# Altium schematic sheet [11] - LCD.SchDoc
size A3; DocumentNumber: 11; SheetNumber: 11; SheetTotal: 18
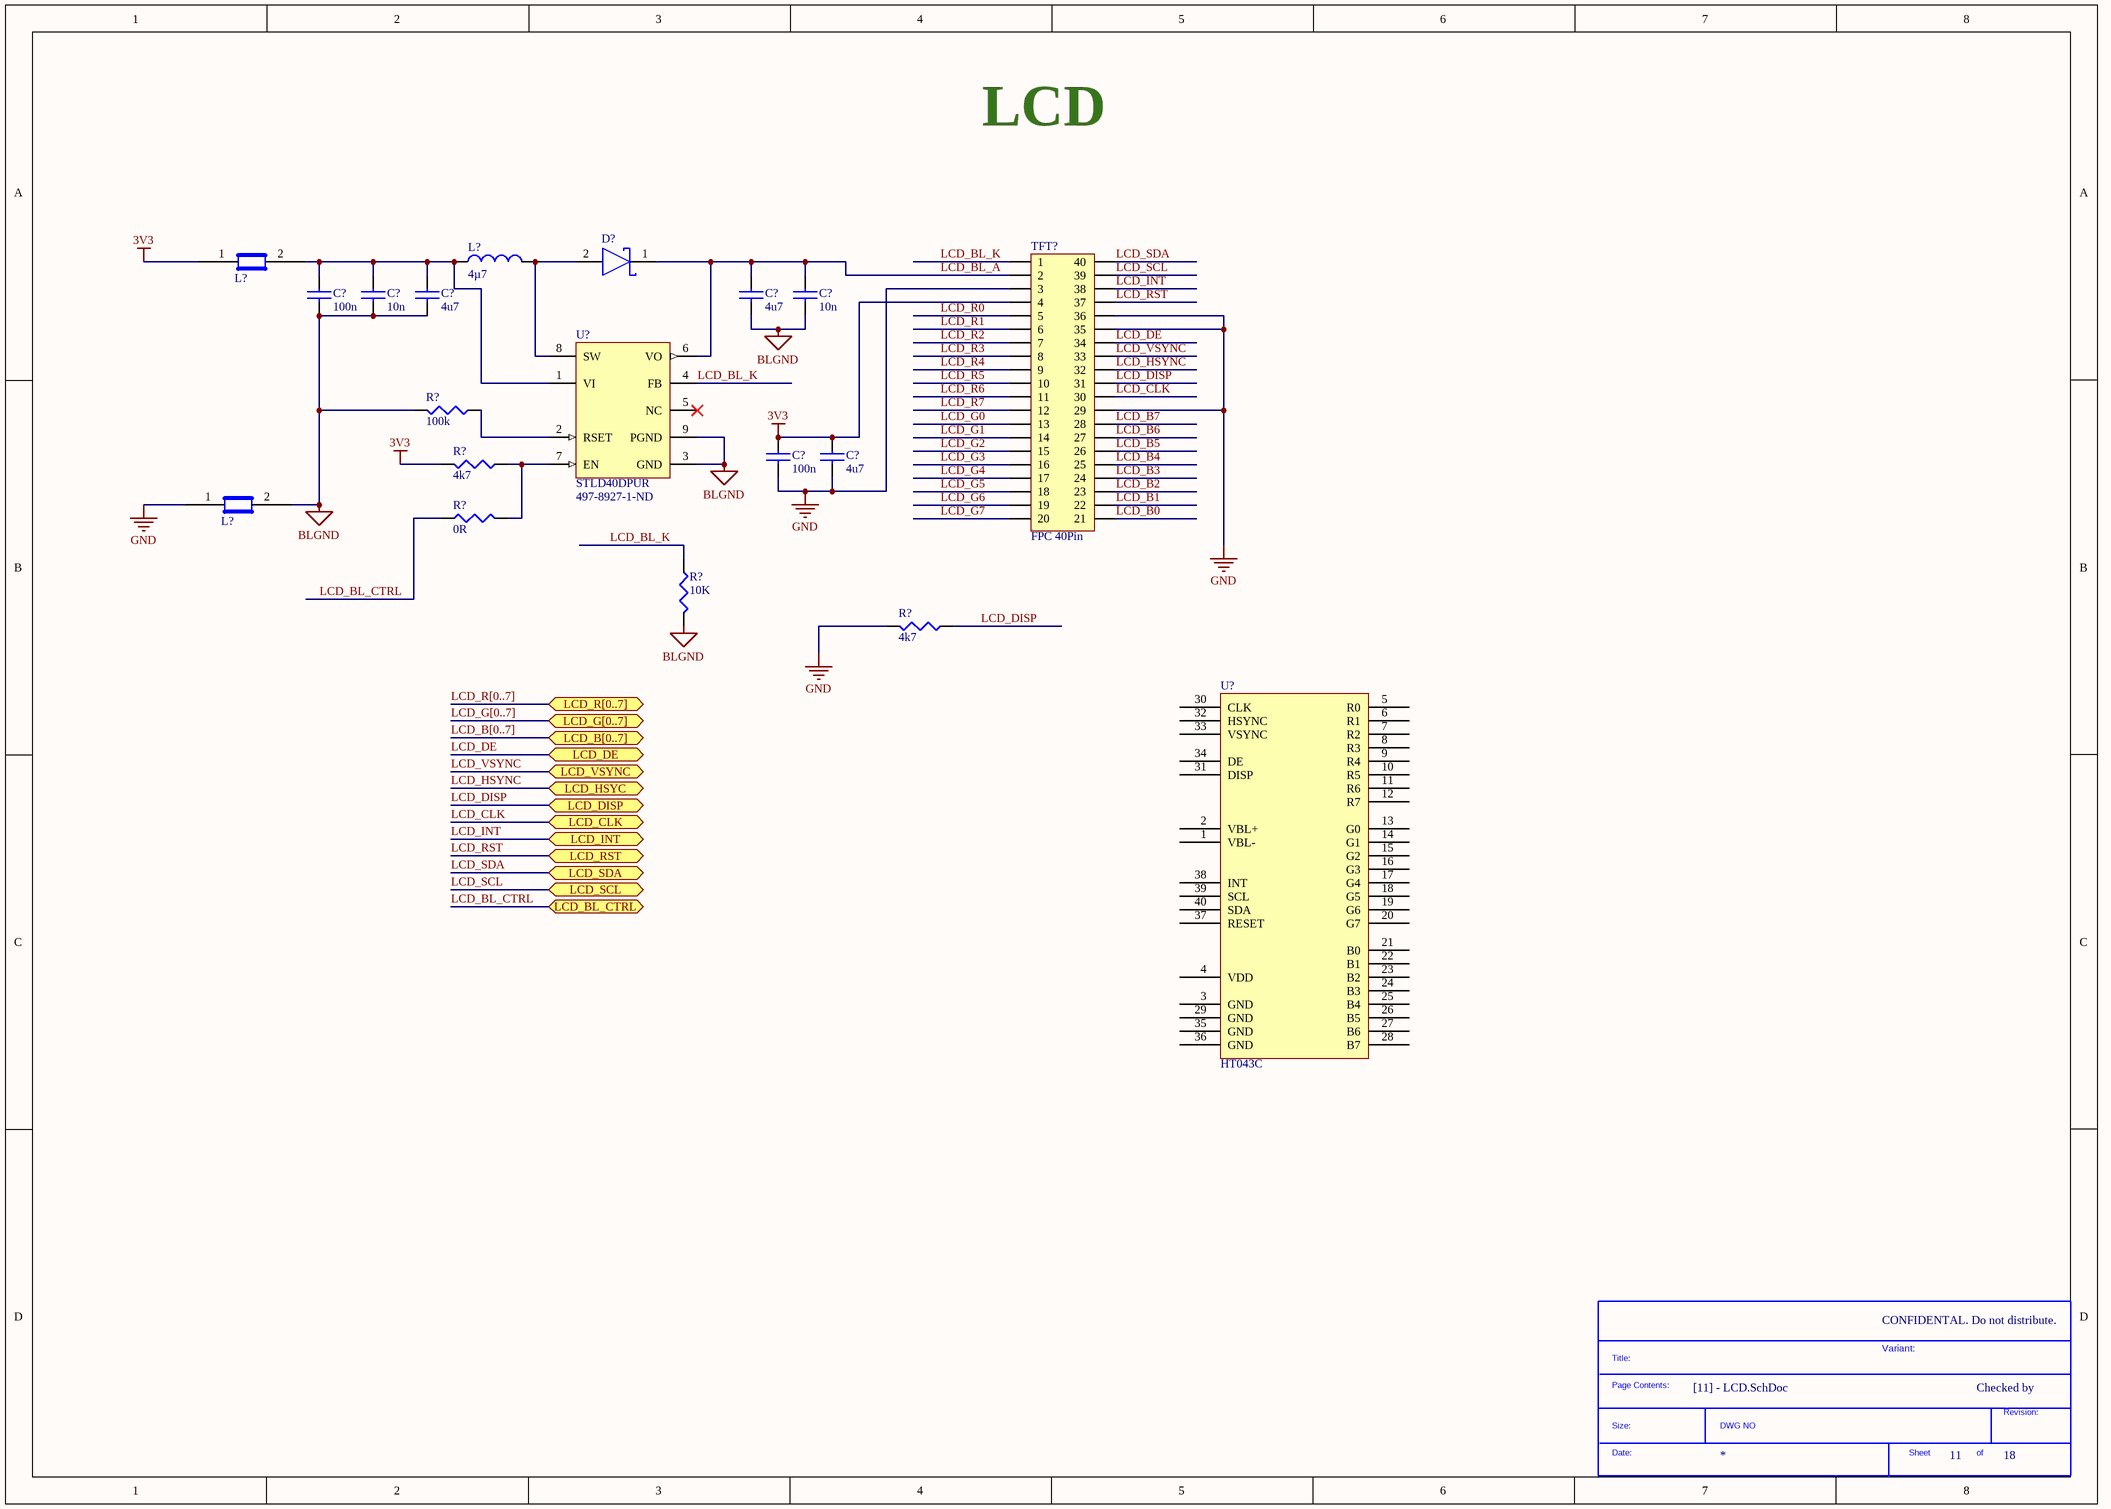
[diagram p0: [11] - LCD.SchDoc]

## Parts
(Parts that share a designator on the sheet are numbered #1, #2 ... from top to bottom, then left to right.)
*  SDTitleBlock  (value not drawn)  (graphical)
C?#1  100n  [C0402]
C?#2  10n  [C0402]
C?#3  4u7  [C0402]
C?#4  4u7  [C0402]
C?#5  10n  [C0402]
C?#6  100n  [C0402]
C?#7  4u7  [C0402]
D?  STPS1L40M  [STPS1L40M]  (value not drawn)
L?#1  MPZ1608S601A 600OHM/1A  [C0603]  (value not drawn)
L?#2  4µ7  [IHLP_255MILx270MIL]
L?#3  MPZ1608S601A 600OHM/1A  [C0603]  (value not drawn)
R?#1  100k  [R0402]
R?#2  4k7  [R0402]
R?#3  0R  [R0402]
R?#4  10K  [R0402]
R?#5  4k7  [R0402]
TFT?  FPC 40Pin  [FPC_40Pin]
U?#1  STLD40DPUR  Supplier Part Number 1: 497-8927-1-ND  [QFN8_V]
U?#2  HT043C  [LCD_Kunjian_ HT043C_40P_P080_FLEX_FOLDED]

## Ports
LCD_B[0..7] (bidir), LCD_BL_CTRL (bidir), LCD_CLK (bidir), LCD_DE (bidir), LCD_DISP (bidir), LCD_G[0..7] (bidir), LCD_HSYC (bidir), LCD_INT (bidir), LCD_R[0..7] (bidir), LCD_RST (bidir), LCD_SCL (bidir), LCD_SDA (bidir), LCD_VSYNC (bidir)

## Nets
3V3: C?#6.1 C?#7.1 L?#1.1 R?#2.2 TFT?.4
BLGND: C?#1.2 C?#2.2 C?#3.2 C?#4.2 C?#5.2 L?#3.2 R?#1.2 R?#4.2 U?#1.3(GND) U?#1.9(PGND)
GND: C?#6.2 C?#7.2 L?#3.1 R?#5.2 TFT?.3 TFT?.29 TFT?.35 TFT?.36
LCD_B0: TFT?.21
LCD_B1: TFT?.22
LCD_B2: TFT?.23
LCD_B3: TFT?.24
LCD_B4: TFT?.25
LCD_B5: TFT?.26
LCD_B6: TFT?.27
LCD_B7: TFT?.28
LCD_BL_A: C?#4.1 C?#5.1 D?.1(K) TFT?.2 U?#1.6(VO)
LCD_BL_CTRL: R?#3.1 ; port LCD_BL_CTRL
LCD_BL_K: R?#4.1 TFT?.1 U?#1.4(FB)
LCD_CLK: TFT?.30 ; port LCD_CLK
LCD_DE: TFT?.34 ; port LCD_DE
LCD_DISP: R?#5.1 TFT?.31 ; port LCD_DISP
LCD_G0: TFT?.13
LCD_G1: TFT?.14
LCD_G2: TFT?.15
LCD_G3: TFT?.16
LCD_G4: TFT?.17
LCD_G5: TFT?.18
LCD_G6: TFT?.19
LCD_G7: TFT?.20
LCD_HSYNC: TFT?.32 ; port LCD_HSYC
LCD_INT: TFT?.38 ; port LCD_INT
LCD_R0: TFT?.5
LCD_R1: TFT?.6
LCD_R2: TFT?.7
LCD_R3: TFT?.8
LCD_R4: TFT?.9
LCD_R5: TFT?.10
LCD_R6: TFT?.11
LCD_R7: TFT?.12
LCD_RST: TFT?.37 ; port LCD_RST
LCD_SCL: TFT?.39 ; port LCD_SCL
LCD_SDA: TFT?.40 ; port LCD_SDA
LCD_VSYNC: TFT?.33 ; port LCD_VSYNC
NetC?#1_1: C?#1.1 C?#2.1 C?#3.1 L?#1.2 L?#2.1 U?#1.1(VI)
NetD?_2: D?.2(A) L?#2.2 U?#1.8(SW)
NetR?#1_1: R?#1.1 U?#1.2(RSET)
NetR?#2_1: R?#2.1 R?#3.2 U?#1.7(EN)

Not connected (* = marked no-connect by the designer): U?#1 5(NC)*; U?#2 1(VBL-) 2(VBL+) 3(GND) 4(VDD) 5(R0) 6(R1) 7(R2) 8(R3) 9(R4) 10(R5) 11(R6) 12(R7) 13(G0) 14(G1) 15(G2) 16(G3) 17(G4) 18(G5) 19(G6) 20(G7) 21(B0) 22(B1) 23(B2) 24(B3) 25(B4) 26(B5) 27(B6) 28(B7) 29(GND) 30(CLK) 31(DISP) 32(HSYNC) 33(VSYNC) 34(DE) 35(GND) 36(GND) 37(RESET) 38(INT) 39(SCL) 40(SDA)

## Buses and harness runs
bus LCD_B[0..7] = port LCD_B[0..7]
bus LCD_G[0..7] = port LCD_G[0..7]
bus LCD_R[0..7] = port LCD_R[0..7]

## Notes on the sheet
- LCD
- CONFIDENTAL. Do not distribute.
- CLOCKS (CPU & PCIE)
- Variant:
- Checked by
- (in symbol SDTitleBlock) Title:; Page Contents:; Revision:; Size:; DWG NO; Date:; Sheet; of

## Library data of the parts
C?#1 C?#6 = C1005X5R1H104K: CAP CER .10UF 50V X5R 10% 0402; Manufacturer: TDK Corporation; Capacitance: 0.1µF; Value: 100nF; .Checked PCB: used; Category: Capacitors; Supplier Part Number: 445-5942-1-ND; Manufacturer Part Number: C1005X5R1H104K; Operating Temperature: -55°C ~ 85°C; Package / Case: 0402 (1005 Metric); Price 1k [$]: 0.02340; .Checked SCH: used; Voltage - Rated: 50V; Supplier: Digikey; Supplier 1: Digi-Key; Supplier Part Number 1: 445-5942-1-ND; RoHS: RoHS Compliant; Stock 1: 106926; Pricing 1: 1=0.27, 10=0.18, 100=0.072, 250=0.05176, 500=0.0369, 1000=0.027 (USD); Tolerance: ±10%; Temperature Coefficient: X5R; Mounting Type: Surface Mount, MLCC; Applications: General Purpose; Ratings: -; Size / Dimension: 0.039" L x 0.020" W (1.00mm x 0.50mm); Height - Seated (Max): -; Thickness (Max): 0.022" (0.55mm); Lead Spacing: -; Features: -; Packaging: Cut Tape (CT); Lead Style: -; ComponentLink1URL: http://www.tdk.co.jp/tefe02/e412_c.pdf; ComponentLink1Description: http://www.tdk.co.jp/tefe02/e412_c.pdf
C?#2 C?#5 = C1005X7R1C103K: CAP CER 10000PF 16V X7R 10% 0402; Manufacturer: TDK Corporation; Value: 10nF; .Checked PCB: used; Capacitance: 10000pF; Category: Capacitors; Manufacturer Part Number: C1005X7R1C103K; Operating Temperature: -55°C ~ 125°C; Package / Case: 0402 (1005 Metric); Price 1k [$]: 0.00416; .Checked SCH: used; Voltage - Rated: 16V; Supplier Part Number: 445-1262-1-ND; Supplier: Digikey; Supplier 1: Digi-Key; Supplier Part Number 1: 445-1262-1-ND; RoHS: RoHS Compliant; Stock 1: 511497; Pricing 1: 1=0.08, 10=0.05, 100=0.018, 250=0.013, 500=0.0096, 1000=0.0065 (USD); Tolerance: ±10%; Temperature Coefficient: X7R; Mounting Type: Surface Mount, MLCC; Applications: General Purpose; Ratings: -; Size / Dimension: 0.039" L x 0.020" W (1.00mm x 0.50mm); Height - Seated (Max): -; Thickness (Max): 0.022" (0.55mm); Lead Spacing: -; Features: -; Packaging: Cut Tape (CT); Lead Style: -; ComponentLink1URL: http://www.tdk.co.jp/tefe02/e412_c.pdf; ComponentLink1Description: http://www.tdk.co.jp/tefe02/e412_c.pdf
C?#3 C?#4 C?#7 = C1005X5R1A475M: CAP CER 4.7UF 10V 20% X5R 0402; Manufacturer: TDK Corporation; Capacitance: 4.7µF; .Checked PCB: RF; Supplier 1: Digi-Key; Supplier Part Number 1: 445-8023-1-ND; Manufacturer Part Number: C1005X5R1A475M; RoHS: RoHS Compliant; Category: Capacitors; Stock 1: 10140; Pricing 1: 1=0.53, 10=0.415, 100=0.25, 250=0.18752, 500=0.16, 1000=0.125, 5000=0.095 (USD); Voltage - Rated: 10V; Tolerance: ±20%; Temperature Coefficient: X5R; Mounting Type: Surface Mount, MLCC; Operating Temperature: -55°C ~ 85°C; Applications: General Purpose; Ratings: -; Package / Case: 0402 (1005 Metric); Size / Dimension: 0.039" L x 0.020" W (1.00mm x 0.50mm); Height - Seated (Max): -; Thickness (Max): -; Lead Spacing: -; Features: -; Packaging: Cut Tape (CT); Lead Style: -; ComponentLink1URL: http://www.tdk.com/pdf/general_B11.pdf; ComponentLink1Description: http://www.tdk.com/pdf/general_B11.pdf; .Checked SCH: RF
L?#1 L?#3 = MPZ1608S601A: FERRITE CHIP BEAD 600 OHM SMD 1A; Manufacturer: TDK Corporation; Impedance @ Frequency: 600 Ohm @ 100MHz; DC Resistance (DCR): 150 mOhm Max; Filter Type: Differential Mode - Single; Number of Lines: 1; .Checked PCB: RF; Supplier 1: Digi-Key; Supplier Part Number 1: 445-2205-1-ND; Manufacturer Part Number: MPZ1608S601A; RoHS: RoHS Compliant; Category: Filters; Stock 1: 328345; Pricing 1: 1=0.36, 10=0.24, 100=0.096, 250=0.069, 500=0.0492, 1000=0.036 (USD); Current Rating: 1A; Package / Case: 0603 (1608 Metric); Mounting Type: Surface Mount; Packaging: Cut Tape (CT); Height (Max): 0.037" (0.95mm); Size / Dimension: 0.063" L x 0.031" W (1.60mm x 0.80mm); ComponentLink1URL: http://www.tdk.co.jp/tefe02/e9413_mpz.pdf; ComponentLink1Description: http://www.tdk.co.jp/tefe02/e9413_mpz.pdf; .Checked SCH: RF
L?#2 = IHLP2525CZER4R7M01: INDUCTOR POWER 4.7UH 5.5A SMD; Manufacturer: Vishay/Dale; .Checked PCB: used; Inductance: 4.7µH; Current - Saturation: 10A; Shielding: Shielded; DC Resistance (DCR): 40 mOhm Max; Tolerance: ±20%; Frequency - Test: 100kHz; .Checked SCH: used; Category: Inductors, Coils, Chokes; Manufacturer Part Number: IHLP2525CZER4R7M01; Operating Temperature: -55°C ~ 125°C; Package / Case: 0.270" L x 0.255" W x 0.118" H (6.86mm x 6.47mm x 3.00mm); Price 1k [$]: 1.09800; Value: 4µ7; Current: 5.5A; Applications: General Purpose; Supplier Part Number: 541-1010-1-ND; Supplier: Digikey; Supplier 1: Digi-Key; Supplier Part Number 1: 541-1010-1-ND; RoHS: RoHS Compliant; Stock 1: 25684; Pricing 1: 1=2.26, 10=1.83, 100=1.525, 500=1.22, 1000=1.098 (USD); Current - Temperature Rise: 5.5A; Type: -; Q @ Freq: -; Frequency - Self Resonant: -; Material - Core: -; Mounting Type: Surface Mount; Packaging: Cut Tape (CT); ComponentLink1URL: http://www.vishay.com/doc?34104; ComponentLink1Description: http://www.vishay.com/doc?34104
R?#1 R?#2 R?#5 = RC0402FR-0710KL: RES 10.0K OHM 1/16W 1% 0402 SMD; Manufacturer: Yageo; Resistance (Ohms): 10K; Power (Watts): 0.063W, 1/16W; Value: 10k; .Checked PCB: used; Temperature Coefficient: ±100ppm/°C; Category: Resistors; Supplier Part Number: 311-10.0KLRCT-ND; Manufacturer Part Number: RC0402FR-0710KL; Package / Case: 0402 (1005 Metric); Price 1k [$]: 0.01421; Tolerance: ±1%; .Checked SCH: used; Supplier: Digikey; Supplier 1: Digi-Key; Supplier Part Number 1: 311-10.0KLRCT-ND; RoHS: RoHS Compliant; Stock 1: 2916495; Pricing 1: 10=0.014, 50=0.0104, 100=0.0079, 250=0.00584, 500=0.00432, 1000=0.00288 (USD); Composition: Thick Film; Features: -; Size / Dimension: 0.039" L x 0.020" W (1.00mm x 0.50mm); Height: 0.016" (0.40mm); Number of Terminations: 2; Packaging: Cut Tape (CT); ComponentLink1URL: http://www.yageo.com/documents/recent/PYu-RC0402_51_RoHS_L_6.pdf; ComponentLink1Description: http://www.yageo.com/documents/recent/PYu-RC0402_51_RoHS_L_6.pdf
R?#3 = CRCW0402330RFKED: RES 330 OHM 1/16W 1% 0402 SMD; Manufacturer: Vishay Dale; Resistance (Ohms): 330; Power (Watts): 0.063W, 1/16W; Temperature Coefficient: ±100ppm/°C; .Checked PCB: RF; Supplier 1: Digi-Key; Supplier Part Number 1: 541-330LCT-ND; Manufacturer Part Number: CRCW0402330RFKED; RoHS: RoHS Compliant; Category: Resistors; Stock 1: 49303; Pricing 1: 10=0.083, 50=0.0444, 200=0.0255, 1000=0.0174 (USD); Composition: Thick Film; Features: -; Tolerance: ±1%; Package / Case: 0402 (1005 Metric); Size / Dimension: 0.039" L x 0.020" W (1.00mm x 0.50mm); Height: 0.016" (0.40mm); Number of Terminations: 2; Packaging: Cut Tape (CT); ComponentLink1URL: http://www.vishay.com/doc?20035; ComponentLink1Description: http://www.vishay.com/doc?20035; .Checked SCH: RF
R?#4 = RC0402FR-07100RL: RES 100 OHM 1/16W 1% 0402 SMD; Manufacturer: Yageo; Resistance (Ohms): 100; Power (Watts): 0.063W, 1/16W; Value: 100R; .Checked PCB: RF; Temperature Coefficient: ±100ppm/°C; Category: Resistors; Supplier Part Number: 311-100LRCT-ND; Manufacturer Part Number: RC0402FR-07100RL; Package / Case: 0402 (1005 Metric); Price 1k [$]: 0.01421; Tolerance: ±1%; .Checked SCH: RF; Supplier: Digikey; Supplier 1: Digi-Key; Supplier Part Number 1: 311-100LRCT-ND; RoHS: RoHS Compliant; Stock 1: 1682040; Pricing 1: 10=0.014, 50=0.0104, 100=0.0079, 250=0.00584, 500=0.00432, 1000=0.00288 (USD); Composition: Thick Film; Features: -; Size / Dimension: 0.039" L x 0.020" W (1.00mm x 0.50mm); Height: 0.016" (0.40mm); Number of Terminations: 2; Packaging: Cut Tape (CT); ComponentLink1URL: http://www.yageo.com/documents/recent/PYu-RC0402_51_RoHS_L_6.pdf; ComponentLink1Description: http://www.yageo.com/documents/recent/PYu-RC0402_51_RoHS_L_6.pdf
TFT? = FPC_40Pin: DISIGNER: ARMAN ARVAND
U?#1 = STLD40DPUR: White Led Power Supply For Large Display Backlight, 8-Pin VFDFPN, Tape and Reel; ComponentLink1Description: Manufacturer URL; ComponentLink2Description: Datasheet; DatasheetVersion: May-2011; ComponentLink1URL: http://www.st.com; PackageVersion: 2011; PackageDescription: 8-Pin Dual Flat No-Lead, 3 x 3 mm Body, 0.65 mm Pitch, Exposed Pad; ComponentLink2URL: http://www.st.com/internet/com/TECHNICAL_RESOURCES/TECHNICAL_LITERATURE/DATASHEET/CD00098098.pdf; PackageReference: QFN8; PartNumber: STLD40DPUR; Supplier 1: Digi-Key
U?#2 = HT043C: 4.3 inch TFT 480*272 pixels with LED Backlight and Capacitive touch panel, high luminance; Manuf_1: KUNJIAN; ECCN_US/EU: EAR99/NEC; Manuf_Part_1: HT043C; Distrib: Sub Co; Ref St: *
D? = STPS1L40M: Supplier 1: Digi-Key; Supplier Part Number 1: 497-3212-1-ND